# Altium schematic sheet Ovweview.SchDoc
size A3; Project: Project?; DrwanWhen: When?; CheckedWhen: When?
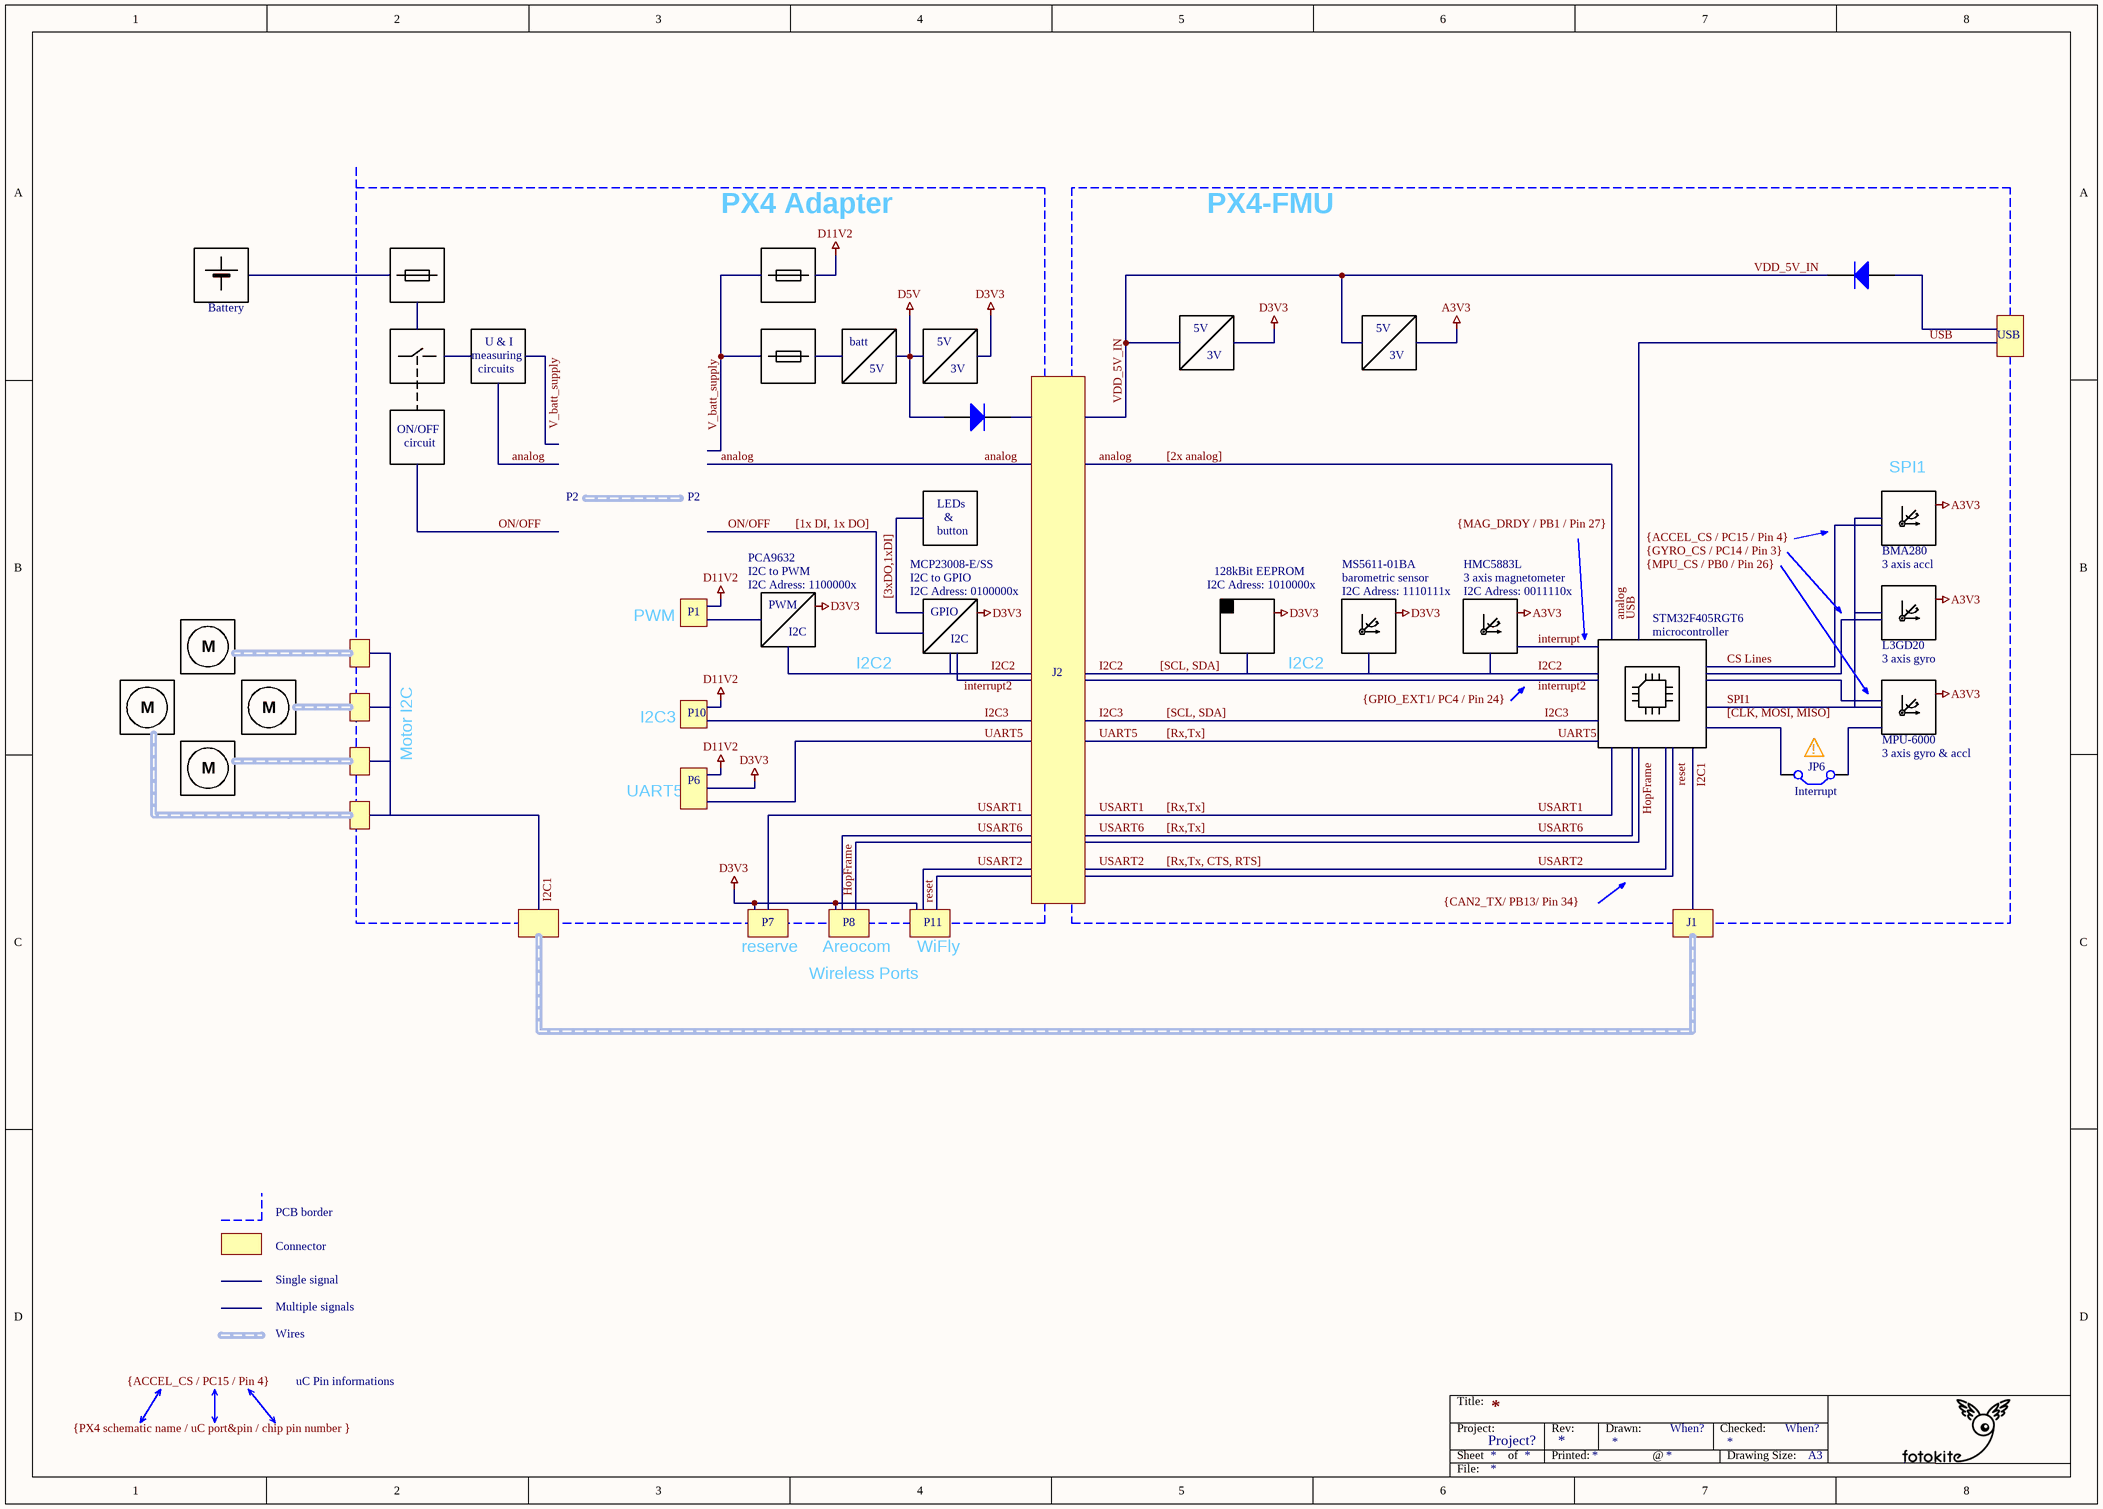
[diagram p0: Ovweview.SchDoc]

## Parts
(Parts that share a designator on the sheet are numbered #1, #2 ... from top to bottom, then left to right.)
128kBit_EEPROM  I2C Adress: 1010000x  (hidden comment: block_empty)  (graphical)
*#1  block_Fuse  (value not drawn)  (graphical)
*#2  block_Fuse  (value not drawn)  (graphical)
*#3  block_Transformer  (value not drawn)  (graphical)
*#4  block_Transformer  (value not drawn)  (graphical)
*#5  block_switch  (value not drawn)  (graphical)
*#6  Note: U & I  (hidden comment: block_empty)  (graphical)
*#7  block_Fuse  (value not drawn)  (graphical)
*#8  block_Transformer  (value not drawn)  (graphical)
*#9  block_Transformer  (value not drawn)  (graphical)
*#10  block_empty  (value not drawn)  (graphical)
*#11  block_empty  (value not drawn)  (graphical)
*#12  block_motor  (value not drawn)  (graphical)
*#13  block_motor  (value not drawn)  (graphical)
*#14  block_motor  (value not drawn)  (graphical)
*#15  sign_attention  (value not drawn)  (graphical)
*#16  block_motor  (value not drawn)  (graphical)
Battery  block_battery  (value not drawn)  (graphical)
BMA280  Note: 3 axis accl  (hidden comment: block_IMU)  (graphical)
D13  Diode  [Mini MELF - SOD-80 -N]  (value not drawn)
D14  Diode  [Mini MELF - SOD-80 -N]  (value not drawn)
HMC5883L  Note: 3 axis magnetometer  I2C Adress: 0011110x  (hidden comment: block_IMU)  (graphical)
JP6  Interrupt  [RES_0603i_1608m -N]
L3GD20  Note: 3 axis gyro  (hidden comment: block_IMU)  (graphical)
MCP23008-E/SS  Note: I2C to GPIO  I2C Adress: 0100000x  (hidden comment: block_Transformer)  (graphical)
MPU-6000  Note: 3 axis gyro & accl  (hidden comment: block_IMU)  (graphical)
MS5611-01BA  Note: barometric sensor  I2C Adress: 1110111x  (hidden comment: block_IMU)  (graphical)
PCA9632  Note: I2C to PWM  I2C Adress: 1100000x  (hidden comment: block_Transformer)  (graphical)
STM32F405RGT6  Note: microcontroller  (hidden comment: block_uC)  (graphical)

## Blocks framed on the sheet
PX4-FMU: 128kBit_EEPROM *#3 *#4 *#15 BMA280 D13 HMC5883L JP6 L3GD20 MPU-6000 MS5611-01BA STM32F405RGT6

## Nets
D5V: D14.1(A)
VDD_5V_IN: D13.2(K)

Not connected (* = marked no-connect by the designer): D13 1(A); D14 2(K); JP6 1(C1) 2(C2)

## Buses and harness runs
bus [1x DI, 1x DO] = ON/OFF
bus [2x analog] = analog
bus [3xDO,1xDI]
bus [Rx,Tx, CTS, RTS] = USART2
bus [Rx,Tx] = UART5
bus [Rx,Tx] = USART1
bus [Rx,Tx] = USART6
bus [SCL, SDA] = I2C2
bus [SCL, SDA] = I2C3
bus analog
bus I2C1
bus ON/OFF
bus SPI1
bus USB

## Notes on the sheet
- PX4 Adapter
- USB
- P2
- SPI1
- PWM
- P1
- I2C3
- P10
- (near MCP23008-E/SS) I2C2
- J2
- (near MS5611-01BA) I2C2
- Motor I2C
- P6
- UART5
- reserve
- P7
- Wireless Ports
- Areocom
- P8
- WiFly
- P11
- J1
- Connector
- PCB border
- Single signal
- Multiple signals
- Wires
- uC Pin informations
- Labels drawn without touching a wire or pin: [CLK, MOSI, MISO], A3V3, D3V3, interrupt2, {ACCEL_CS / PC15 / Pin 4}, {CAN2_TX/ PB13/ Pin 34}, {GPIO_EXT1/ PC4 / Pin 24}, {GYRO_CS / PC14 / Pin 3}, {MAG_DRDY / PB1 / Pin 27}, {MPU_CS / PB0 / Pin 26}, {PX4 schematic name / uC port&pin / chip pin number }
- Sheet
- Project:
- Title:
- of
- Rev:
- Printed:
- Drawn:
- @
- Checked:
- Drawing Size:
- A3
- File:
- (in symbol block_empty) LEDs; &; button; ON/OFF; circuit; measuring; circuits
- (in symbol block_motor) M
- (in symbol block_Transformer) PWM; I2C; GPIO; batt; 5V; 3V
- (in symbol sign_attention) !

## Library data of the parts
*#3 *#4 *#8 *#9 MCP23008-E/SS PCA9632 = block_Transformer: general Transformer
  *#3 *#4 *#8 *#9: Note: *
D13 D14 = Diode: Default Diode
JP6 = Jumper: Jumper Wire
128kBit_EEPROM *#6 *#10 *#11 = block_empty
  128kBit_EEPROM *#10 *#11: Note: *
*#1 *#2 *#7 = block_Fuse: Note: *
*#5 = block_switch: Note: *
*#12-*#14 *#16 = block_motor: Note: *
Battery = block_battery: Note: *